# Altium schematic sheet Main.SchDoc
size A4
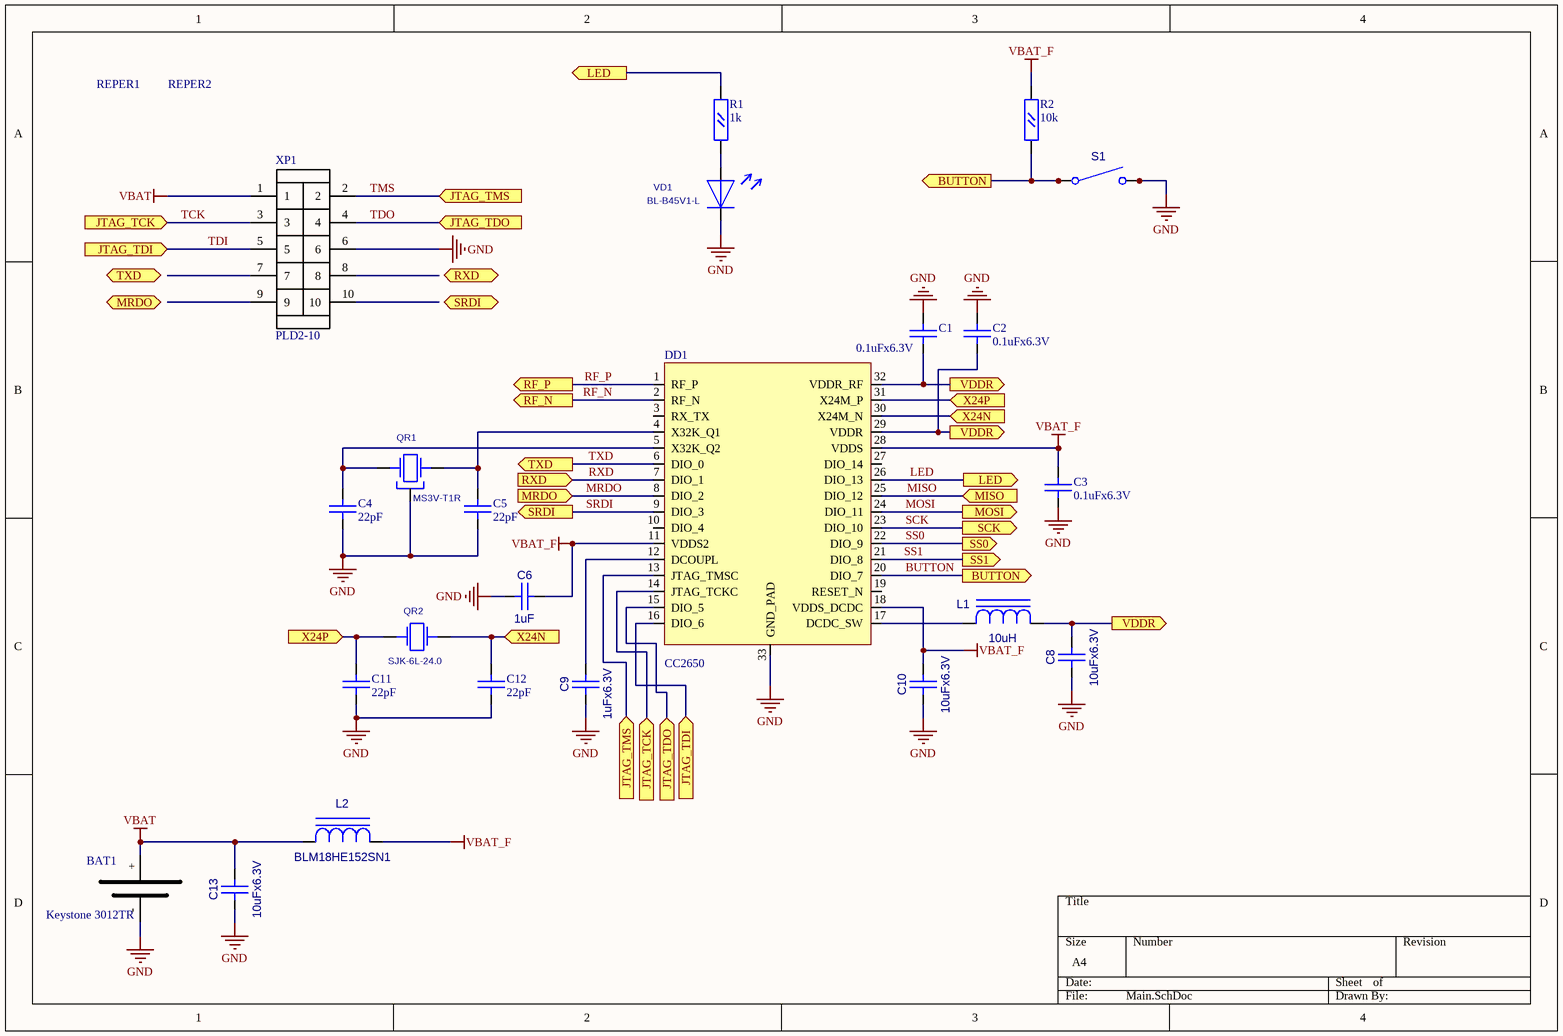
[diagram p0: Main.SchDoc]

## Parts
BAT1  Keystone 3012TR  [BAT_1632]
C1  0.1uFx6.3V  [CC0402]
C2  0.1uFx6.3V  [CC0402]
C3  0.1uFx6.3V  [CC0402]
C4  22pF  [CC0402]
C5  22pF  [CC0402]
C6  1uF  [CC0603]
C8  10uFx6.3V  [CC0603]
C9  1uFx6.3V  [CC0603]
C10  10uFx6.3V  [CC0603]
C11  22pF  [CC0402]
C12  22pF  [CC0402]
C13  10uFx6.3V  [CC0603]
DD1  CC2650  [QFN32_TI]
L1  10uH  [L0603]
L2  BLM18HE152SN1  [L0603]
QR1  MS3V-T1R  [MS3V-T1R]
QR2  SJK-6L-24.0  [AC5032_2]
R1  1k  [RC0402]
R2  10k  [RC0402]
REPER1  REPER1.2  [REPER1.2]  (value not drawn)
REPER2  REPER1.2  [REPER1.2]  (value not drawn)
S1  DTSM-61N  [DTSM-61N]  (value not drawn)
VD1  BL-B45V1-L  [LED3]
XP1  PLD2-10  [PLD2-10]

## Ports
BUTTON (out), JTAG_TCK (in), JTAG_TDI (in), JTAG_TDO (in), JTAG_TMS (in), LED (out), MISO (in), MOSI (out), MRDO (in), RF_N (out), RF_P (out), RXD (in), SCK (out), SRDI (out), SS0 (out), SS1 (out), TXD (out), VDDR (out), X24N (in), X24P (in)

## Nets
GND: BAT1.- C1.2(B) C2.2(B) C3.1(A) C4.1(A) C5.1(A) C6.1(A) C8.1(A) C9.1(A) C10.1(A) C11.1(A) C12.1(A) C13.1(A) DD1.33(GND_PAD) QR1.3 S1.3(C2) S1.4 VD1.1 XP1.6
VBAT: BAT1.+ C13.2(B) L2.1(A) XP1.1
VBAT_F: C3.2(B) C6.2(B) C10.2(B) DD1.11(VDDS2) DD1.18(VDDS_DCDC) DD1.28(VDDS) L2.2(C) R2.2(B)
BUTTON: DD1.20(DIO_7) R2.1(A) S1.1(C1) S1.2 ; port BUTTON
LED: DD1.26(DIO_13) R1.2(B) ; port LED
MISO: DD1.25(DIO_12) ; port MISO
MOSI: DD1.24(DIO_11) ; port MOSI
MRDO: DD1.8(DIO_2) ; port MRDO
RF_N: DD1.2(RF_N) ; port RF_N
RF_P: DD1.1(RF_P) ; port RF_P
RXD: DD1.7(DIO_1) ; port RXD
SCK: DD1.23(DIO_10) ; port SCK
SRDI: DD1.9(DIO_3) ; port SRDI
SS0: DD1.22(DIO_9) ; port SS0
SS1: DD1.21(DIO_8) ; port SS1
TCK: DD1.14(JTAG_TCKC) XP1.3 ; port JTAG_TCK
TDI: DD1.16(DIO_6) XP1.5 ; port JTAG_TDI
TDO: DD1.15(DIO_5) XP1.4 ; port JTAG_TDO
TMS: DD1.13(JTAG_TMSC) XP1.2 ; port JTAG_TMS
TXD: DD1.6(DIO_0) ; port TXD
VDDR: C1.1(A) C2.1(A) C8.2(B) DD1.29(VDDR) DD1.32(VDDR_RF) L1.2(C) ; port VDDR
X24N: C12.2(B) DD1.30(X24M_N) QR2.2 ; port X24N
X24P: C11.2(B) DD1.31(X24M_P) QR2.1 ; port X24P
NetC4_2: C4.2(B) DD1.5(X32K_Q2) QR1.2(X2)
NetC5_2: C5.2(B) DD1.4(X32K_Q1) QR1.1(X1)
NetC9_2: C9.2(B) DD1.12(DCOUPL)
NetDD1_17: DD1.17(DCDC_SW) L1.1(A)
NetR1_1: R1.1(A) VD1.2

Not connected (* = marked no-connect by the designer): DD1 3(RX_TX) 10(DIO_4) 19(RESET_N) 27(DIO_14); REPER1 1; REPER2 1; XP1 7 8 9 10

## Library data of the parts
BAT1 = BAT_1632: Value: Keystone 3012TR
C1-C5 C11 C12 = CC0402
  C1-C3: Value: 0.1uFx6.3V
  C4 C5 C11 C12: Value: 22pF
C6 C8-C10 C13 = CC0603
  C6: Value: 1uF
  C8 C10 C13: Value: 10uFx6.3V
  C9: Value: 1uFx6.3V
DD1 = CC2650RHB: CC2650RHBT; Value: CC2650
L1 L2 = L0603
  L1: Value: 10uH
  L2: Value: BLM18HE152SN1
QR1 = MS3V-T1R: CRYSTAL_32768 Hz; Value: *
QR2 = AC5032_2: AC5032/2; Value: SJK-6L-24.0
R1 R2 = RC0402
  R1: Value: 1k
  R2: Value: 10k
S1 = DTSM-61N: Switch, Single Pole, Single Throw, Normally Open; Value: {Value}
VD1 = LED_3: Value: BL-B45V1-L
REPER1 REPER2 = REPER1.2: Value: *
XP1 = PLD2-10: Value: PLD2-10